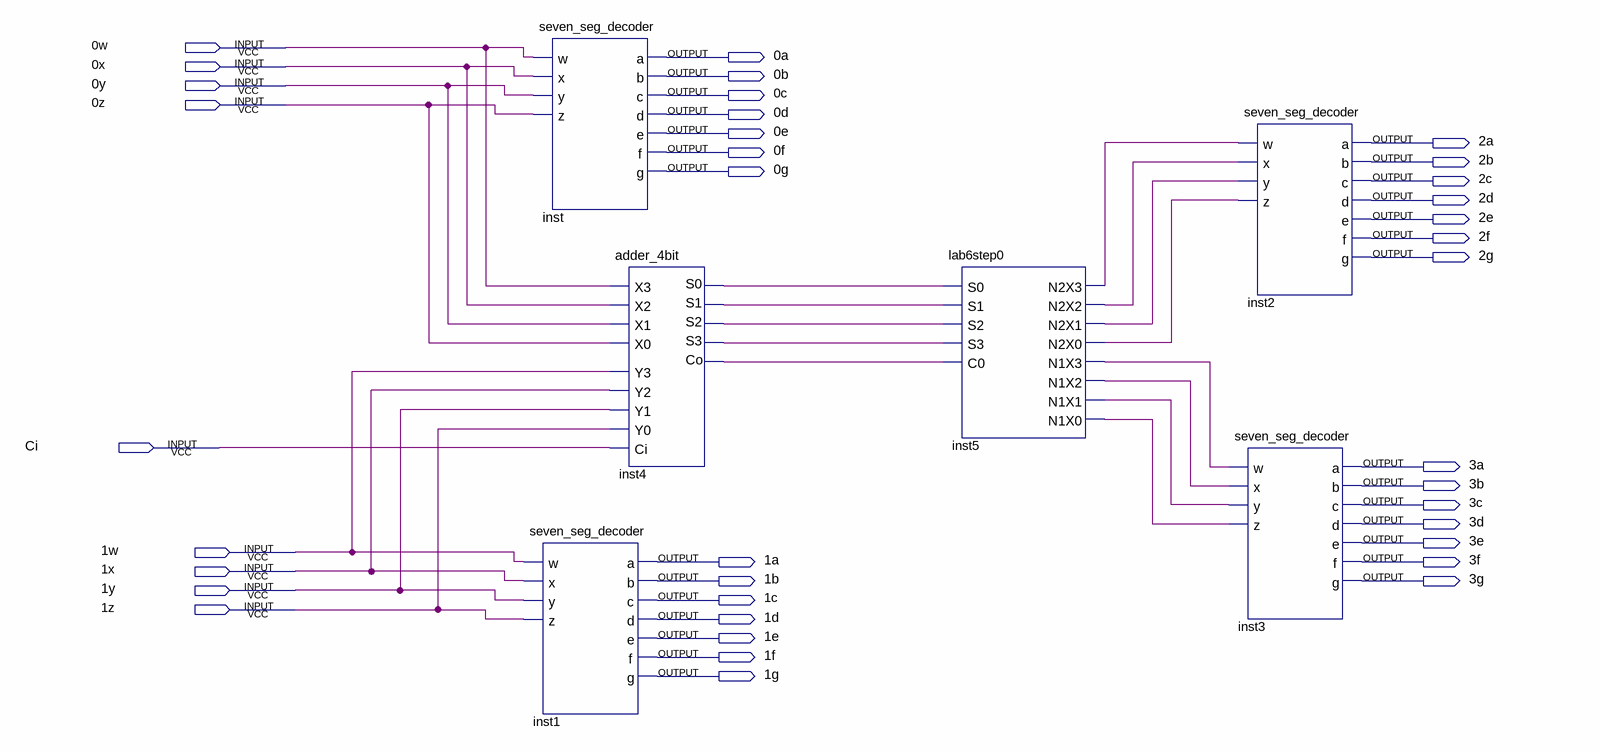
[diagram p0: schematic sheet]
// Quartus schematic lab6.bdf as structural Verilog: 6 symbols, 37 pins
module lab6 (
  input  \0w ,
  input  \0x ,
  input  \0y ,
  input  \0z ,
  input  Ci,
  input  \1w ,
  input  \1x ,
  input  \1y ,
  input  \1z ,
  output \0a ,
  output \0b ,
  output \0c ,
  output \0d ,
  output \0e ,
  output \2a ,
  output \0f ,
  output \2b ,
  output \0g ,
  output \2c ,
  output \2d ,
  output \2e ,
  output \2f ,
  output \2g ,
  output \3a ,
  output \3b ,
  output \3c ,
  output \3d ,
  output \3e ,
  output \1a ,
  output \3f ,
  output \1b ,
  output \3g ,
  output \1c ,
  output \1d ,
  output \1e ,
  output \1f ,
  output \1g 
);

  wire inst4_co, inst4_s0, inst4_s1, inst4_s2, inst4_s3, inst5_n1x0, inst5_n1x1, inst5_n1x2, inst5_n1x3,
       inst5_n2x0, inst5_n2x1, inst5_n2x2, inst5_n2x3;

  seven_seg_decoder inst (
    .w(\0w ), .x(\0x ), .y(\0y ), .z(\0z ), .a(\0a ), .b(\0b ), .c(\0c ), .d(\0d ), .e(\0e ), .f(\0f ),
    .g(\0g ));
  seven_seg_decoder inst1 (
    .w(\1w ), .x(\1x ), .y(\1y ), .z(\1z ), .a(\1a ), .b(\1b ), .c(\1c ), .d(\1d ), .e(\1e ), .f(\1f ),
    .g(\1g ));
  adder_4bit inst4 (
    .X3(\0w ), .Y3(\1w ), .X2(\0x ), .Y2(\1x ), .X1(\0y ), .Y1(\1y ), .X0(\0z ), .Y0(\1z ), .Ci(Ci),
    .S0(inst4_s0), .S1(inst4_s1), .S2(inst4_s2), .S3(inst4_s3), .Co(inst4_co));
  lab6step0 inst5 (
    .S0(inst4_s0), .S1(inst4_s1), .S2(inst4_s2), .S3(inst4_s3), .C0(inst4_co), .N2X3(inst5_n2x3),
    .N2X2(inst5_n2x2), .N2X1(inst5_n2x1), .N2X0(inst5_n2x0), .N1X3(inst5_n1x3), .N1X2(inst5_n1x2),
    .N1X1(inst5_n1x1), .N1X0(inst5_n1x0));
  seven_seg_decoder inst2 (
    .w(inst5_n2x3), .x(inst5_n2x2), .y(inst5_n2x1), .z(inst5_n2x0), .a(\2a ), .b(\2b ), .c(\2c ), .d(\2d ),
    .e(\2e ), .f(\2f ), .g(\2g ));
  seven_seg_decoder inst3 (
    .w(inst5_n1x3), .x(inst5_n1x2), .y(inst5_n1x1), .z(inst5_n1x0), .a(\3a ), .b(\3b ), .c(\3c ), .d(\3d ),
    .e(\3e ), .f(\3f ), .g(\3g ));
endmodule
